# EAGLE design TempSensor-2b (EAGLE 9.6.2)
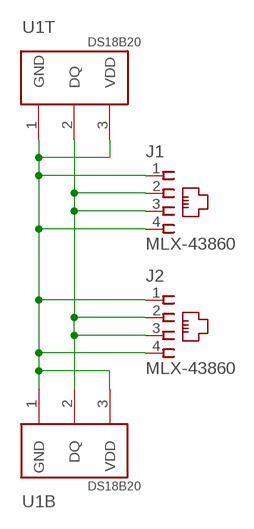
[diagram p0: schematic, sheet 1]

## Parts
J1  MLX-43860  [MLX-43860]
J2  MLX-43860  [MLX-43860]
U1B  DS18B20  [TO92-]
U1T  DS18B20  [TO92-]

## Nets
1W [10 mil]: J1.2 J1.3 J2.2 J2.3 U1B.2(DQ) U1T.2(DQ)
GND [10 mil]: J1.1 J1.4 J2.1 J2.4 U1B.1(GND) U1B.3(VDD) U1T.1(GND) U1T.3(VDD)

## Library data of the parts
J1 J2 = home:MLX-43860: RJ11 Connector Source: MOLEX 43860-003; FAM: 43860; MF: MOLEX; VAR: 0003
U1B U1T = home:DS18B20: Programmable Resolution Digital Thermometer This chip provides a onewire thermosensor with approx. 0.5°C accuracy. A programmable over/undertemperure alarm is available. The precision can be set from 9..12 bits. Notes: Vdd must be applied for accurate measurements at low temperatures, as the parasite power circuit otherwise heats the sensor. If parasite power is used, Vdd has to be connected to GND. The DS1822 is a low-cost thermometer chip, the DS18S20 is similar to the DS18B20, but with 9 Bit precision only. Author: Jan Kandziora <jjj@gmx.de>

## Net classes
0 default: width 0.203 mm
1 10 mil: width 0.254 mm

## Board
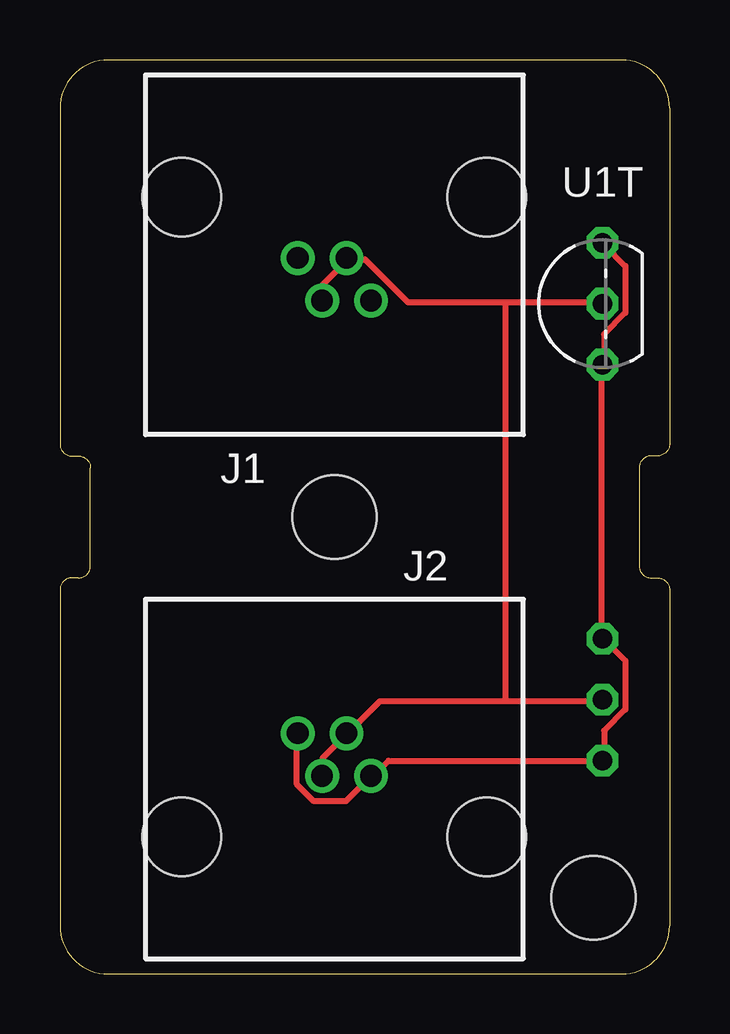
[diagram p1: board, top side]
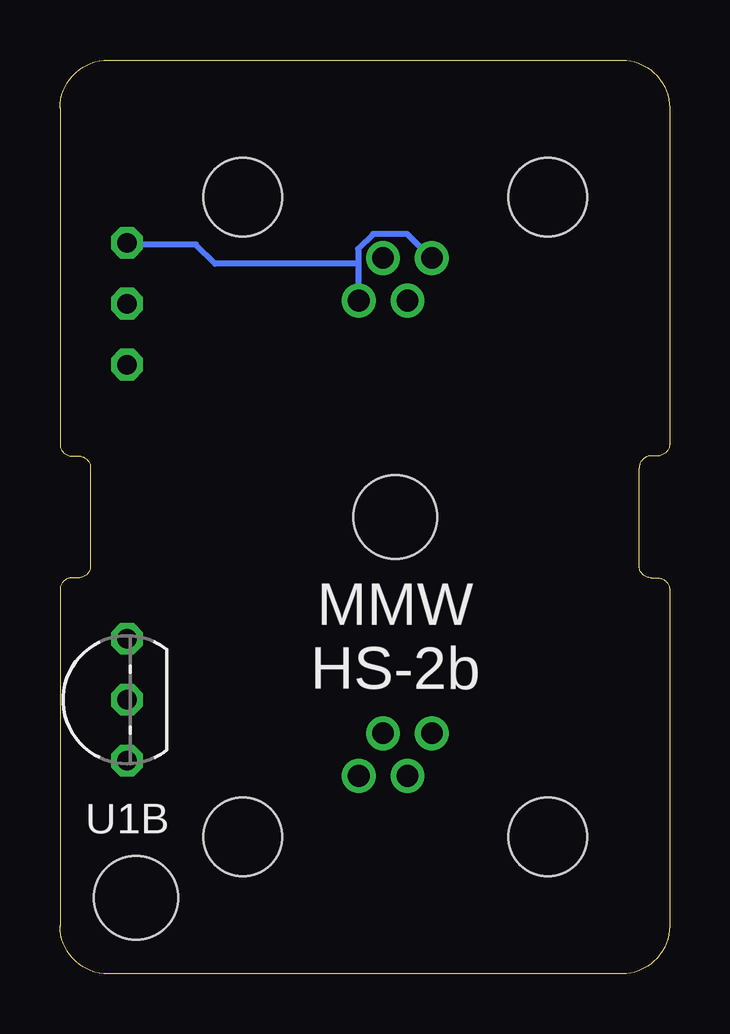
[diagram p2: board, bottom side, seen from below]

Size 25.4 x 38.1 mm. Coordinates in mm from the lower left corner, seen from the top.
Outline: 2,0 23.4,0 arc90 25.4,2 25.4,16.01 arc90 24.9,16.51 24.63,16.51 arc-90 24.13,17.01 24.13,21.09 arc-90 24.63,21.59 24.9,21.59 arc90 25.4,22.09 25.4,36.1 arc90 23.4,38.1 2,38.1 arc90 0,36.1 0,22.09 arc90 0.5,21.59 0.77,21.59 arc-90 1.27,21.09 1.27,17.01 arc-90 0.77,16.51 0.5,16.51 arc90 0,16.01 0,2 arc90 2,0
Copper layers (1*16): Top 0.035mm / dielectric 1.5mm / Bottom 0.035mm
Design rules "default *": minimum track width 8mil, minimum drill 0.35mm, track to track 6mil, track to pad 6mil, pad to pad 6mil, via to via 6mil, smd to smd 6mil, copper to edge 40mil, drill to drill 6mil, minimum pad ring 10mil, minimum via ring 8mil, stop-mask expansion 4mil, vias tented up to drill 0mil, thermal gap 10mil
Holes 3.5 mm at 11.43,19.05 22.23,3.17

### Footprints (pad centres in the part's own frame; a part is rotated, then mirrored left to right if it is on the bottom)
MLX-43860 = drill 0.9 pad 0.914: 1 1.524,0.127; 2 0.508,1.905; 3 -0.508,0.127; 4 -1.524,1.905 | hole 3.277: -6.35,-2.413; 6.35,-2.413
TO92- = drill 0.813 octagon: 1 -2.54,0; 2 0,0; 3 2.54,0

### Placement (x,y rotation side)
J1  11.43,29.97 180 top
J2  11.43,8.13 0 top
U1B  22.61,11.43 90 bottom
U1T  22.61,27.94 90 top

### Tracks (layer width: path | path; a pad name or v marks a point on that pad's centre or on a via)
1W
  Top 0.254: 18.58,28 14.49,28 12.71,29.78 12,29.78 J1.3 11.91,29.69 10.94,28.71 10.94,28.09 J1.2 | 18.58,28 22.58,28 U1T.2 | 18.58,11.38 13.34,11.38 12,10.05 J2.2 11.91,9.96 10.94,8.98 10.94,8.27 J2.3 | 18.58,11.38 22.58,11.38 U1B.2 | 18.58,11.38 18.58,28
GND
  Top 0.254: U1T.3 22.67,30.4 23.56,29.52 23.56,27.56 22.67,26.67 22.67,25.43 U1T.1 22.58,25.34 22.58,14.05 U1B.3 22.67,13.96 23.56,13.07 23.56,11.02 22.67,10.13 22.67,8.89 U1B.1 13.69,8.89 13.07,8.27 J2.1 12.89,8.18 11.91,7.2 10.58,7.2 9.87,7.91 9.87,9.96 J2.4
  Bottom 0.254: 12.98,29.6 12.98,30.23 12.36,30.85 10.94,30.85 9.96,29.87 J1.1 | 12.98,29.6 12.98,28.09 J1.4 | 12.98,29.6 18.94,29.6 19.74,30.4 22.58,30.4 U1T.3

### Text on the board
bPlace: MMW / HS-2b